# Altium project cs_consolidated.PrjPcb (part 3 of 3)
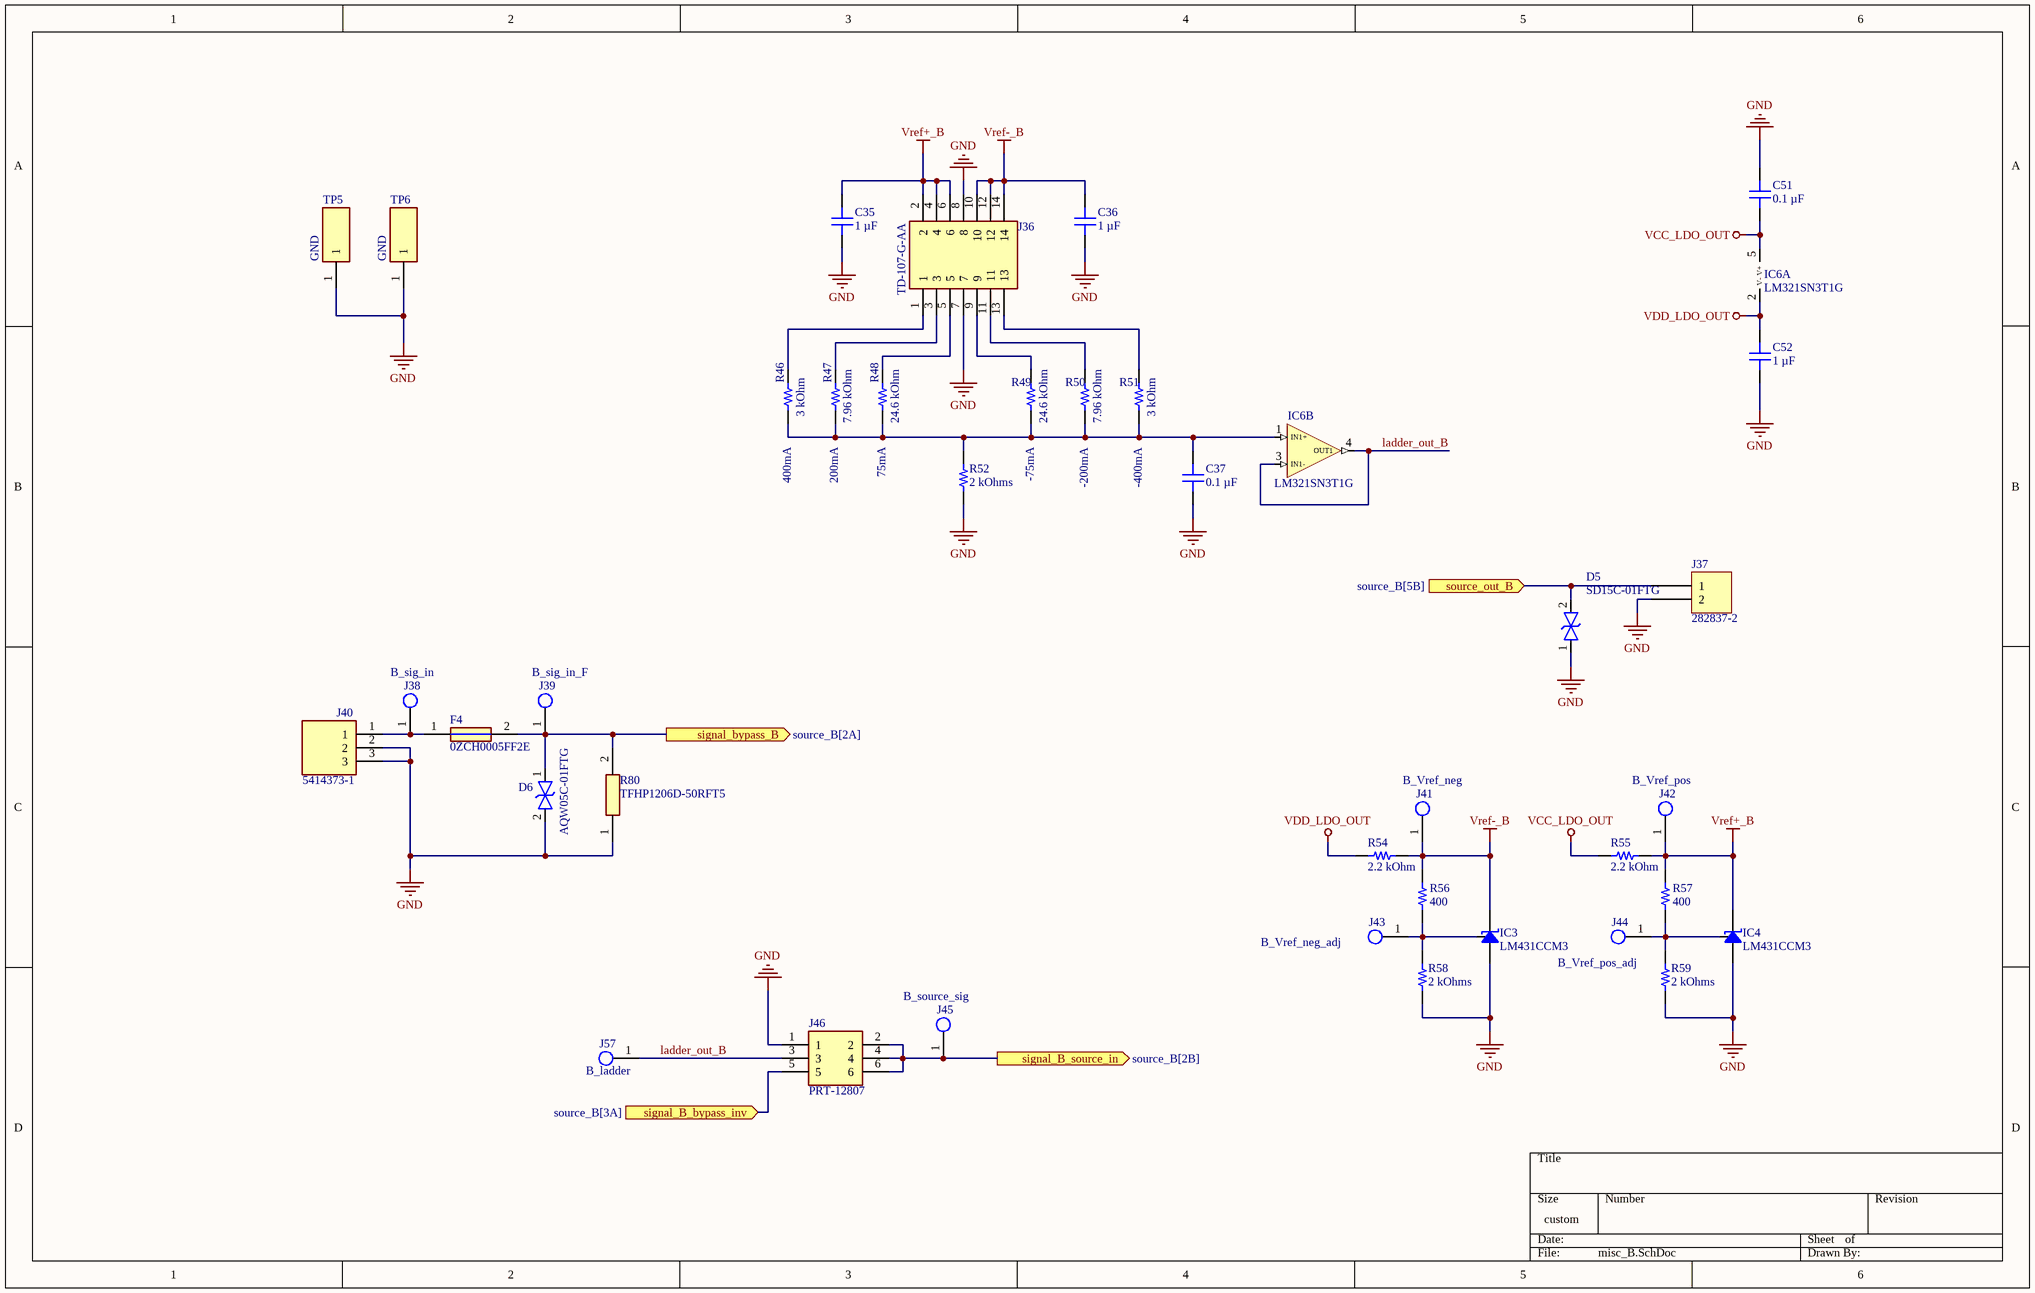
[diagram p6: misc_B.SchDoc]

## Nets that join several sheets
GND: power (16 pins), LDO (16 pins), misc_A (21 pins), source_A (16 pins), source_B (16 pins), misc_B (21 pins)
VCC: power (8 pins), LDO (C25.2 L3.1 U4.3), source_A (Q1.3 Q2.7_8 R17.2 R18.2), source_B (Q6.7_8 Q9.3 R62.2 R63.2)
VCC_LDO_OUT: LDO (6 pins), misc_A (C49.2 IC5.5 R10.2), source_A (6 pins), source_B (6 pins), misc_B (C51.2 IC6.5 R55.2)
VDD: power (8 pins), LDO (5 pins), source_A (Q2.5_6 Q4.3 R27.1 R28.1), source_B (Q6.5_6 Q10.3 R72.1 R73.1)
VDD_LDO_OUT: LDO (6 pins), misc_A (C50.1 IC5.2 R9.2), source_A (6 pins), source_B (6 pins), misc_B (C52.1 IC6.2 R54.2)
NetD1_2: misc_A (D1.2 J2.1), source_A (J16.1 R21.1 R26.1)
NetD2_1: misc_A (D2.1 F1.2 J4.1 R79.2), source_A (R16.2)
NetD5_2: source_B (J51.1 R66.1 R71.1), misc_B (D5.2 J37.1)
NetD6_1: source_B (R61.2), misc_B (D6.1 F4.2 J39.1 R80.2)
NetJ10_1: misc_A (J10.1 J11.2 J11.4 J11.6), source_A (R22.2)
NetJ11_5: misc_A (J11.5), source_A (R15.2 U1.1)
NetJ45_1: source_B (R67.2), misc_B (J45.1 J46.2 J46.4 J46.6)
NetJ46_5: source_B (R60.2 U6.1), misc_B (J46.5)